# Altium schematic sheet S04_SOM1_C_D.SchDoc: SOM1 C & D
size 381 x 241 mm; SheetNumber: 4; SheetTotal: 12
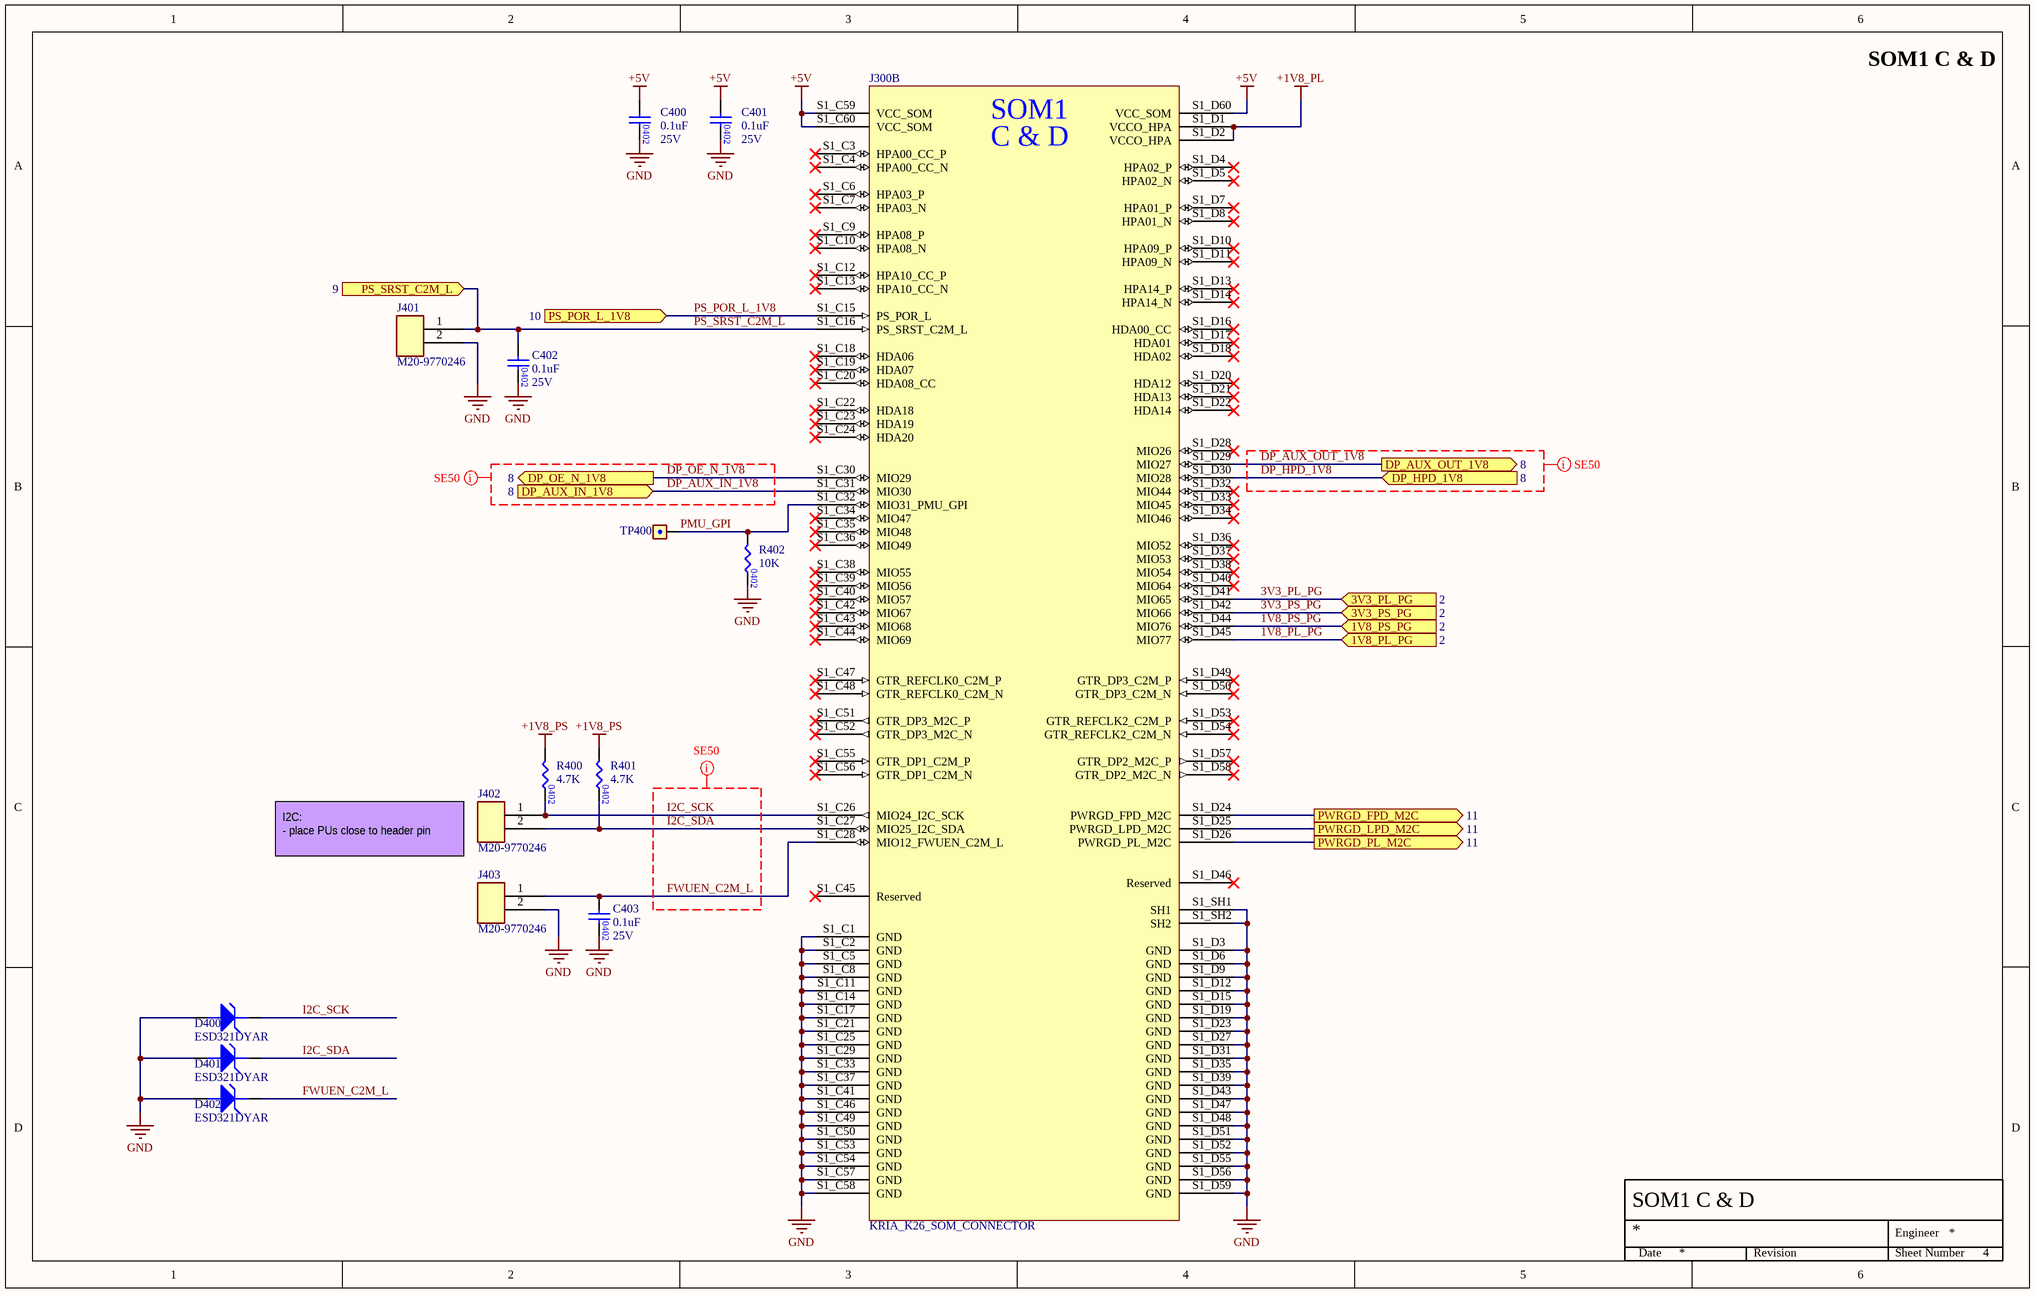
[diagram p0: S04_SOM1_C_D.SchDoc]

## Parts
C400  value 0.1uF  Voltage Rating: 25V  [CAP0402]  (hidden comment: CAP_0402)
C401  value 0.1uF  Voltage Rating: 25V  [CAP0402]  (hidden comment: CAP_0402)
C402  value 0.1uF  Voltage Rating: 25V  [CAP0402]  (hidden comment: CAP_0402)
C403  value 0.1uF  Voltage Rating: 25V  [CAP0402]  (hidden comment: CAP_0402)
D400  ESD321DYAR  [TI_SOD523]
D401  ESD321DYAR  [TI_SOD523]
D402  ESD321DYAR  [TI_SOD523]
J300  KRIA_K26_SOM_CONNECTOR  [KRIA_K26_SOM]  (part B of 4)
J401  M20-9770246  [61300211121]
J402  M20-9770246  [61300211121]
J403  M20-9770246  [61300211121]
R400  Resistance: 4.7K  [RES0402]  (hidden comment: RES_0402)
R401  Resistance: 4.7K  [RES0402]  (hidden comment: RES_0402)
R402  Resistance: 10K  [RES0402]  (hidden comment: RES_0402)
TP400  1mm Round Pad Testpoint  [TP_1MM]  (value not drawn)

## Ports
1V8_PL_PG (in, see 2), 1V8_PS_PG (in, see 2), 3V3_PL_PG (in, see 2), 3V3_PS_PG (in, see 2), DP_AUX_IN_1V8 (in, see 8), DP_AUX_OUT_1V8 (out, see 8), DP_HPD_1V8 (in, see 8), DP_OE_N_1V8 (out, see 8), PS_POR_L_1V8 (in, see 10), PS_SRST_C2M_L (in, see 9), PWRGD_FPD_M2C (out, see 11), PWRGD_LPD_M2C (out, see 11), PWRGD_PL_M2C (out, see 11)

## Nets
+1V8_PL: J300.S1_D1(VCCO_HPA) J300.S1_D2(VCCO_HPA)
+1V8_PS: R400.1 R401.1
+5V: C400.1 C401.1 J300.S1_C59(VCC_SOM) J300.S1_C60(VCC_SOM) J300.S1_D60(VCC_SOM)
GND: C400.2 C401.2 C402.2 C403.2 D400.A(Anode) D401.A(Anode) D402.A(Anode) J300.S1_C1(GND) J300.S1_C2(GND) J300.S1_C5(GND) J300.S1_C8(GND) J300.S1_C11(GND) J300.S1_C14(GND) J300.S1_C17(GND) J300.S1_C21(GND) J300.S1_C25(GND) J300.S1_C29(GND) J300.S1_C33(GND) J300.S1_C37(GND) J300.S1_C41(GND) J300.S1_C46(GND) J300.S1_C49(GND) J300.S1_C50(GND) J300.S1_C53(GND) J300.S1_C54(GND) J300.S1_C57(GND) J300.S1_C58(GND) J300.S1_D3(GND) J300.S1_D6(GND) J300.S1_D9(GND) J300.S1_D12(GND) J300.S1_D15(GND) J300.S1_D19(GND) J300.S1_D23(GND) J300.S1_D27(GND) J300.S1_D31(GND) J300.S1_D35(GND) J300.S1_D39(GND) J300.S1_D43(GND) J300.S1_D47(GND) J300.S1_D48(GND) J300.S1_D51(GND) J300.S1_D52(GND) J300.S1_D55(GND) J300.S1_D56(GND) J300.S1_D59(GND) J300.S1_SH1(SH1) J300.S1_SH2(SH2) J401.2 J403.2 R402.2
1V8_PL_PG: J300.S1_D45(MIO77) ; port 1V8_PL_PG
1V8_PS_PG: J300.S1_D44(MIO76) ; port 1V8_PS_PG
3V3_PL_PG: J300.S1_D41(MIO65) ; port 3V3_PL_PG
3V3_PS_PG: J300.S1_D42(MIO66) ; port 3V3_PS_PG
DP_AUX_IN_1V8: J300.S1_C31(MIO30) ; port DP_AUX_IN_1V8
DP_AUX_OUT_1V8: J300.S1_D29(MIO27) ; port DP_AUX_OUT_1V8
DP_HPD_1V8: J300.S1_D30(MIO28) ; port DP_HPD_1V8
DP_OE_N_1V8: J300.S1_C30(MIO29) ; port DP_OE_N_1V8
FWUEN_C2M_L: C403.1 D402.K(Cathode) J300.S1_C28(MIO12_FWUEN_C2M_L) J403.1
I2C_SCK: D400.K(Cathode) J300.S1_C26(MIO24_I2C_SCK) J402.1 R400.2
I2C_SDA: D401.K(Cathode) J300.S1_C27(MIO25_I2C_SDA) J402.2 R401.2
PMU_GPI: J300.S1_C32(MIO31_PMU_GPI) R402.1 TP400.1
PS_POR_L_1V8: J300.S1_C15(PS_POR_L) ; port PS_POR_L_1V8
PS_SRST_C2M_L: C402.1 J300.S1_C16(PS_SRST_C2M_L) J401.1 ; port PS_SRST_C2M_L
PWRGD_FPD_M2C: J300.S1_D24(PWRGD_FPD_M2C) ; port PWRGD_FPD_M2C
PWRGD_LPD_M2C: J300.S1_D25(PWRGD_LPD_M2C) ; port PWRGD_LPD_M2C
PWRGD_PL_M2C: J300.S1_D26(PWRGD_PL_M2C) ; port PWRGD_PL_M2C

Not connected (* = marked no-connect by the designer): J300 S1_C3(HPA00_CC_P)* S1_C4(HPA00_CC_N)* S1_C6(HPA03_P)* S1_C7(HPA03_N)* S1_C9(HPA08_P)* S1_C10(HPA08_N)* S1_C12(HPA10_CC_P)* S1_C13(HPA10_CC_N)* S1_C18(HDA06)* S1_C19(HDA07)* S1_C20(HDA08_CC)* S1_C22(HDA18)* S1_C23(HDA19)* S1_C24(HDA20)* S1_C34(MIO47)* S1_C35(MIO48)* S1_C36(MIO49)* S1_C38(MIO55)* S1_C39(MIO56)* S1_C40(MIO57)* S1_C42(MIO67)* S1_C43(MIO68)* S1_C44(MIO69)* S1_C45(Reserved)* S1_C47(GTR_REFCLK0_C2M_P)* S1_C48(GTR_REFCLK0_C2M_N)* S1_C51(GTR_DP3_M2C_P)* S1_C52(GTR_DP3_M2C_N)* S1_C55(GTR_DP1_C2M_P)* S1_C56(GTR_DP1_C2M_N)* S1_D4(HPA02_P)* S1_D5(HPA02_N)* S1_D7(HPA01_P)* S1_D8(HPA01_N)* S1_D10(HPA09_P)* S1_D11(HPA09_N)* S1_D13(HPA14_P)* S1_D14(HPA14_N)* S1_D16(HDA00_CC)* S1_D17(HDA01)* S1_D18(HDA02)* S1_D20(HDA12)* S1_D21(HDA13)* S1_D22(HDA14)* S1_D28(MIO26)* S1_D32(MIO44)* S1_D33(MIO45)* S1_D34(MIO46)* S1_D36(MIO52)* S1_D37(MIO53)* S1_D38(MIO54)* S1_D40(MIO64)* S1_D46(Reserved)* S1_D49(GTR_DP3_C2M_P)* S1_D50(GTR_DP3_C2M_N)* S1_D53(GTR_REFCLK2_C2M_P)* S1_D54(GTR_REFCLK2_C2M_N)* S1_D57(GTR_DP2_M2C_P)* S1_D58(GTR_DP2_M2C_N)*

## Layout directives
net class SE50: DP_AUX_IN_1V8, DP_AUX_OUT_1V8, DP_HPD_1V8, DP_OE_N_1V8, FWUEN_C2M_L, I2C_SCK, I2C_SDA

## Notes on the sheet
- I2C:
  - place PUs close to header pin
- Engineer
- Date
- Revision
- Sheet Number
- (in symbol KRIA_K26_SOM, part B) SOM1; C & D

## Library data of the parts
C400-C403 = CAP_CL05A104KA5NNNC: CAP CER 0.1UF 25V X5R 0402; Manufacturer: Samsung Electro-Mechanics; Tolerance: 10%; Manufacturer Part Number 1: CL05A104KA5NNNC; Case/Package: 0402; Mounting Type: Surface Mount; Temperature Coefficient: X5R
D400-D402 = ESD321DYAR: TVS DIODE 3.6VWM 6.3VC SOT5X3; Manfacturer Part Number: ESD321DYAR
J300 = KRIA_K26_SOM: 2 x 240 pos Samtec REF-226081-01; Number of Positions: 480; Manufacturer: Samtec; Manufacturer Part NUmber: REF-226081-01; Number of Rows: 8
J401-J403 = M20-9770246: CONN HEADER VERT 2POS 2.54MM; Positions: 2; Rows: 1; Manufacturer Part Number: M20-9770246
R400 R401 = .RES_RC0402FR-074K7L: RES 4.7K OHM 1% 1/16W 0402; Manufacturer: YAGEO; Manufacturer Part Number: RC0402FR-074K7L; Case/Package: 0402; Tolerance: 1%
R402 = .RES_RC0402FR-0710KL: RES 10K OHM 1% 1/16W 0402; Manufacturer: YAGEO; Manufacturer Part Number: RC0402FR-0710KL; Case/Package: 0402; Tolerance: 1%
TP400 = TP_1MM